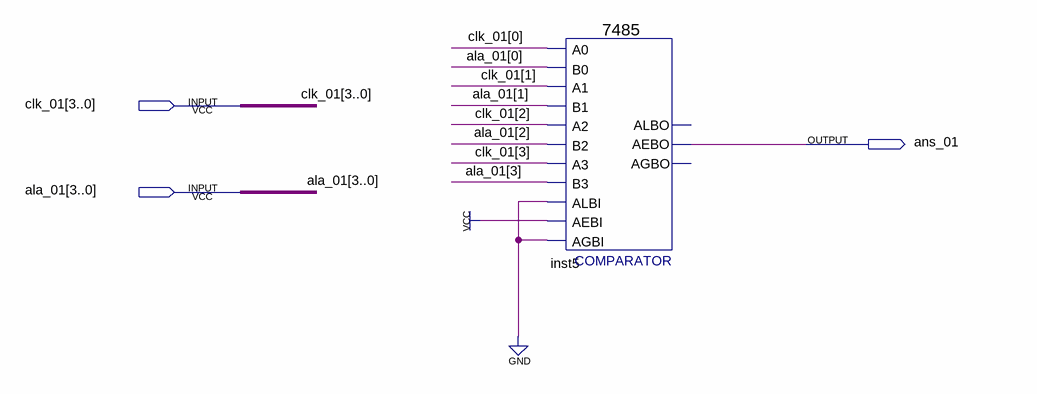
[diagram p0: schematic sheet]
// Quartus schematic com_xnor.bdf as structural Verilog: 1 symbols, 3 pins
module com_xnor (
  input  [3:0] clk_01,
  input  [3:0] ala_01,
  output ans_01
);

  \7485  inst5 (
    .A3(clk_01[3]), .B2(ala_01[2]), .A2(clk_01[2]), .AEBI(1'b1), .AGBI(1'b0), .ALBI(1'b0), .A0(clk_01[0]),
    .B0(ala_01[0]), .B3(ala_01[3]), .A1(clk_01[1]), .B1(ala_01[1]), .AEBO(ans_01));  // open: ALBO, AGBO
endmodule
